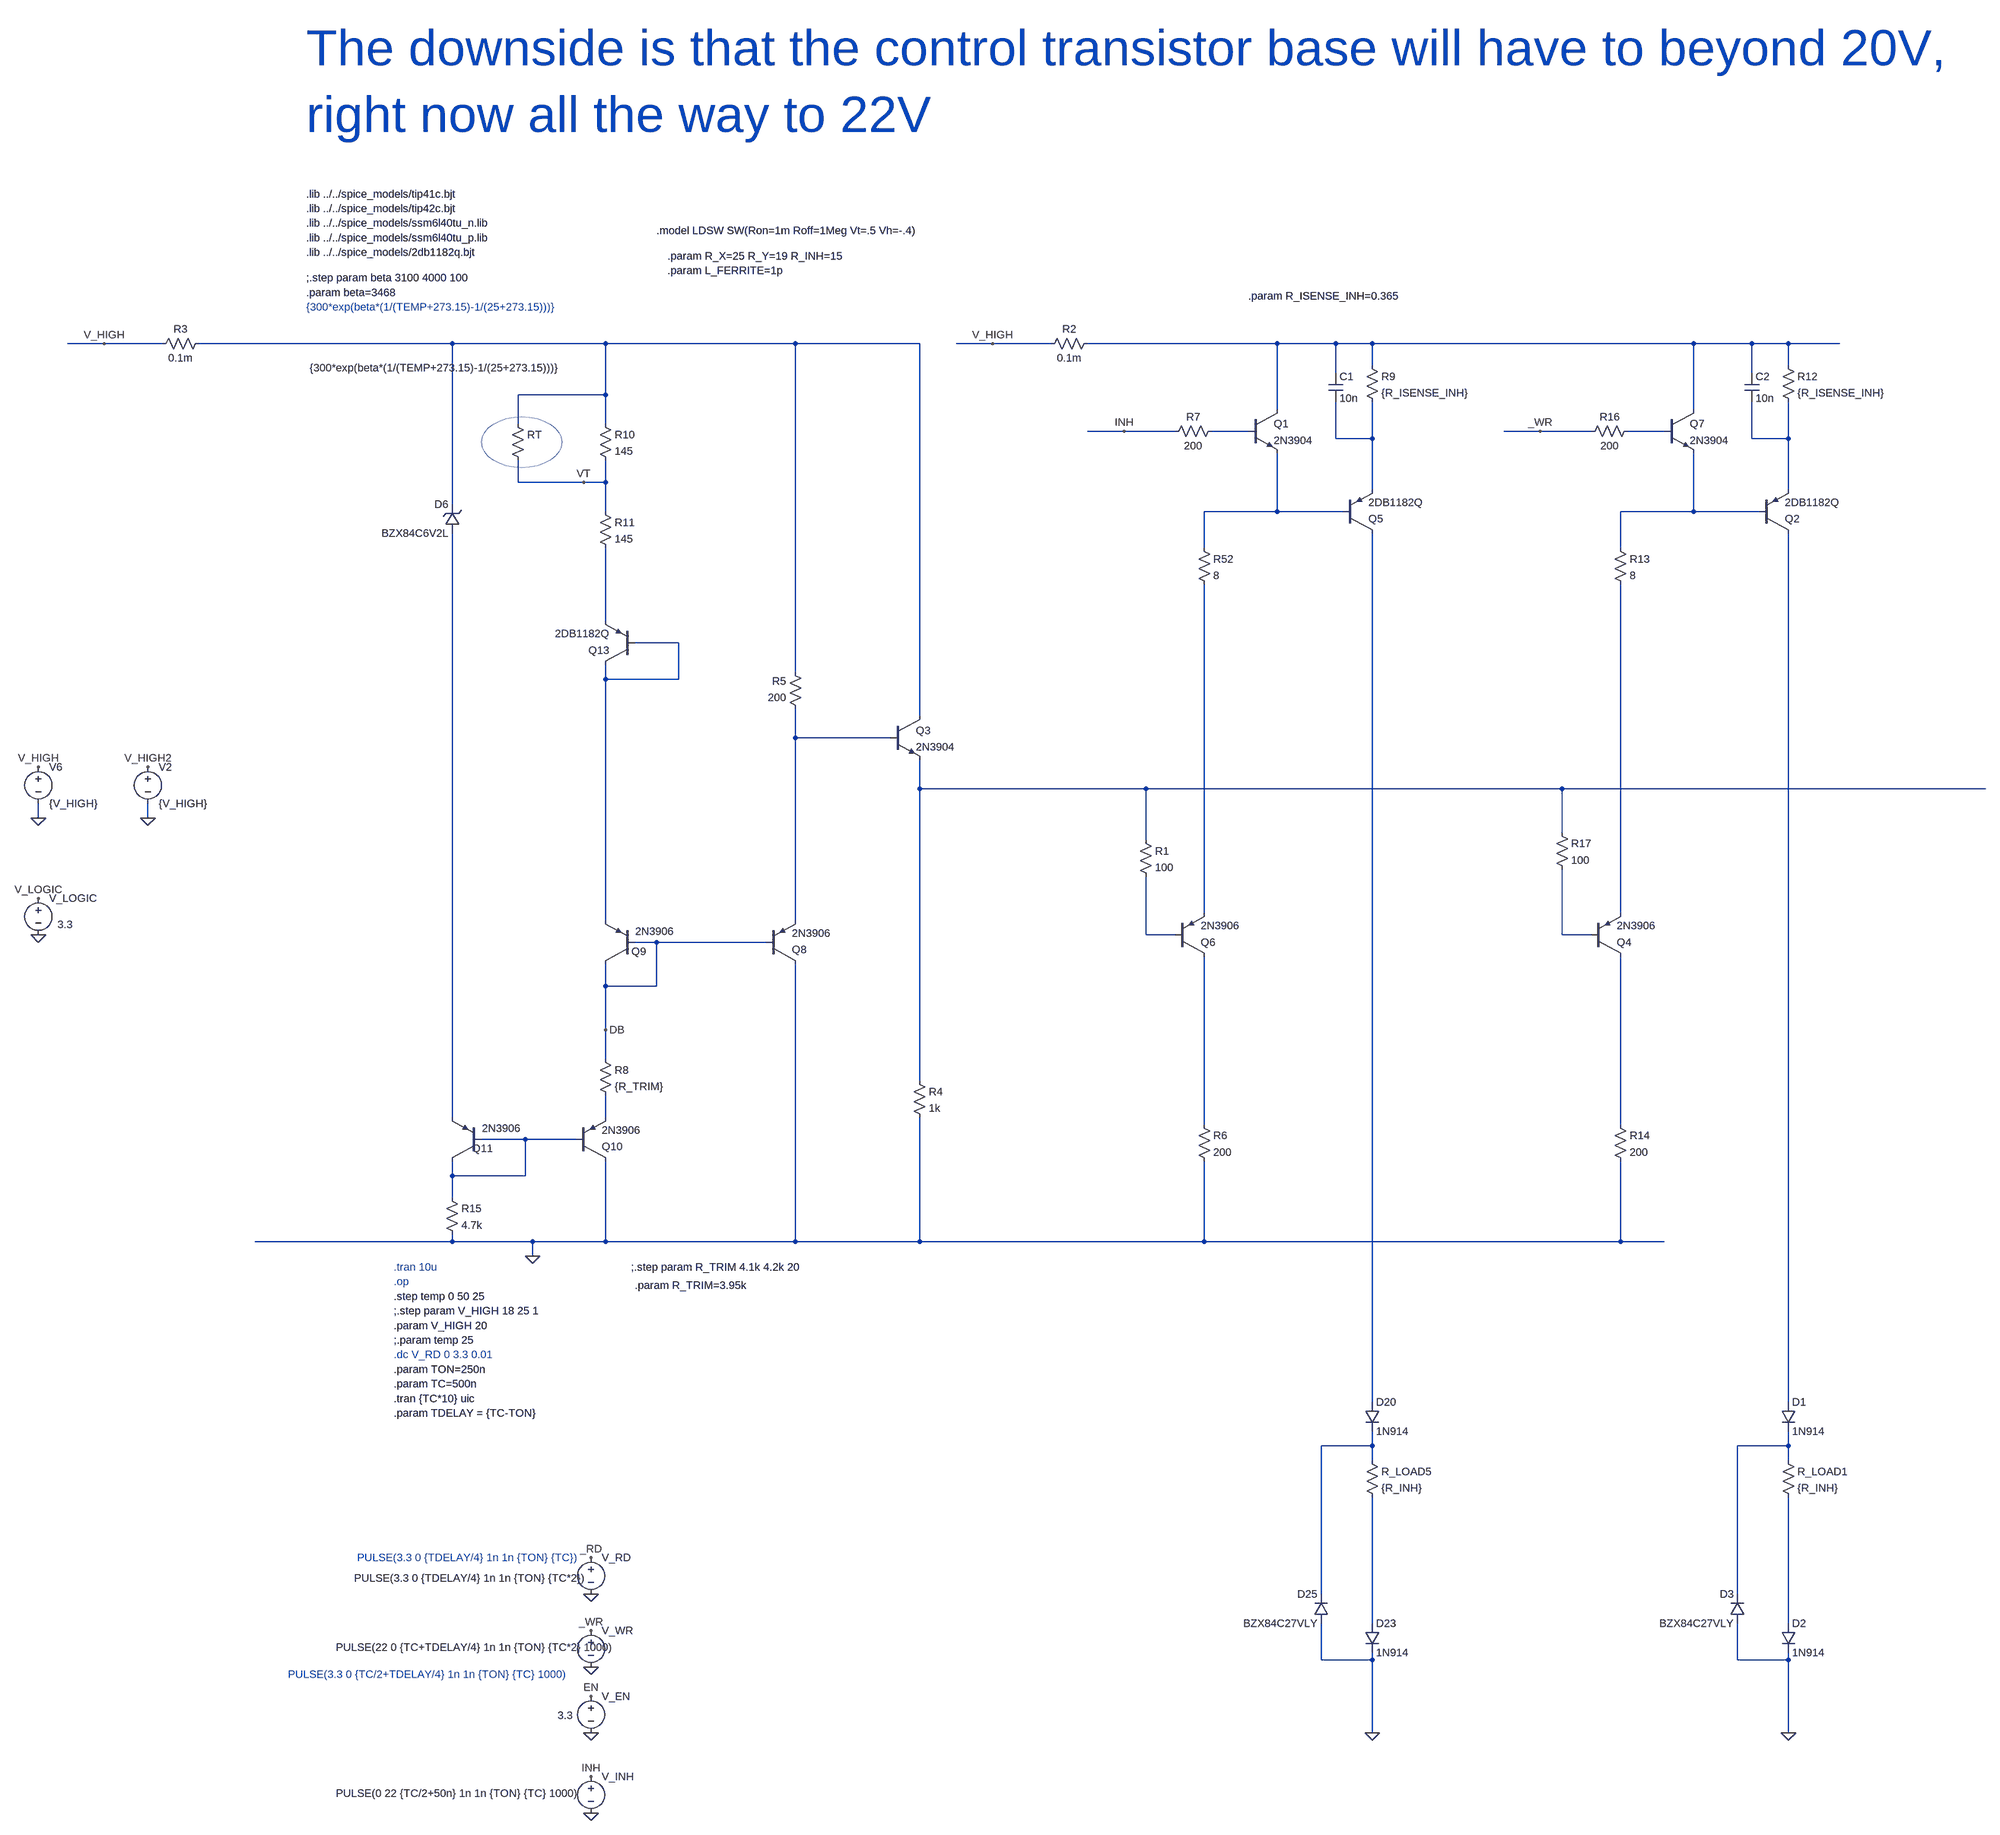
[diagram p0: schematic current_source_with_switch.asc]
current_source_with_switch.asc, the LTspice schematic file:
Version 4.1
SHEET 1 14296 6532
WIRE -1088 -3552 -1168 -3552
WIRE -960 -3552 -1088 -3552
WIRE -320 -3552 -880 -3552
WIRE 16 -3552 -320 -3552
WIRE 432 -3552 16 -3552
WIRE 704 -3552 432 -3552
WIRE 864 -3552 784 -3552
WIRE 992 -3552 864 -3552
WIRE 1488 -3552 1072 -3552
WIRE 1616 -3552 1488 -3552
WIRE 1696 -3552 1616 -3552
WIRE 2400 -3552 1696 -3552
WIRE 2528 -3552 2400 -3552
WIRE 2608 -3552 2528 -3552
WIRE 2720 -3552 2608 -3552
WIRE 1696 -3504 1696 -3552
WIRE 2608 -3504 2608 -3552
WIRE 1616 -3488 1616 -3552
WIRE 2528 -3488 2528 -3552
WIRE 16 -3440 16 -3552
WIRE 16 -3440 -176 -3440
WIRE 1488 -3408 1488 -3552
WIRE 2400 -3408 2400 -3552
WIRE -176 -3376 -176 -3440
WIRE 16 -3376 16 -3440
WIRE 1152 -3360 1072 -3360
WIRE 1264 -3360 1152 -3360
WIRE 1424 -3360 1344 -3360
WIRE 2064 -3360 1984 -3360
WIRE 2176 -3360 2064 -3360
WIRE 2336 -3360 2256 -3360
WIRE 1616 -3344 1616 -3424
WIRE 1696 -3344 1696 -3424
WIRE 1696 -3344 1616 -3344
WIRE 2528 -3344 2528 -3424
WIRE 2608 -3344 2608 -3424
WIRE 2608 -3344 2528 -3344
WIRE -176 -3248 -176 -3296
WIRE -32 -3248 -176 -3248
WIRE 16 -3248 16 -3296
WIRE 16 -3248 -32 -3248
WIRE 1696 -3232 1696 -3344
WIRE 2608 -3232 2608 -3344
WIRE -320 -3200 -320 -3552
WIRE 16 -3184 16 -3248
WIRE 1488 -3184 1488 -3312
WIRE 1488 -3184 1328 -3184
WIRE 1632 -3184 1488 -3184
WIRE 2400 -3184 2400 -3312
WIRE 2400 -3184 2240 -3184
WIRE 2544 -3184 2400 -3184
WIRE 1328 -3104 1328 -3184
WIRE 2240 -3104 2240 -3184
WIRE 16 -2944 16 -3104
WIRE 176 -2896 80 -2896
WIRE 432 -2832 432 -3552
WIRE 16 -2816 16 -2848
WIRE 176 -2816 176 -2896
WIRE 176 -2816 16 -2816
WIRE 704 -2736 704 -3552
WIRE 432 -2688 432 -2752
WIRE 640 -2688 432 -2688
WIRE 704 -2576 704 -2640
WIRE 1200 -2576 704 -2576
WIRE 2112 -2576 1200 -2576
WIRE 3040 -2576 2112 -2576
WIRE -1232 -2512 -1232 -2544
WIRE -992 -2512 -992 -2544
WIRE 2112 -2480 2112 -2576
WIRE 1200 -2464 1200 -2576
WIRE 1328 -2304 1328 -3024
WIRE 2240 -2304 2240 -3024
WIRE 16 -2288 16 -2816
WIRE 432 -2288 432 -2688
WIRE 1200 -2256 1200 -2384
WIRE 1264 -2256 1200 -2256
WIRE 2112 -2256 2112 -2400
WIRE 2176 -2256 2112 -2256
WIRE 128 -2240 80 -2240
WIRE 368 -2240 128 -2240
WIRE 16 -2144 16 -2192
WIRE 128 -2144 128 -2240
WIRE 128 -2144 16 -2144
WIRE 16 -2048 16 -2144
WIRE 16 -1984 16 -2048
WIRE 704 -1936 704 -2576
WIRE -320 -1856 -320 -3136
WIRE 16 -1856 16 -1904
WIRE 1328 -1840 1328 -2208
WIRE 2240 -1840 2240 -2208
WIRE -160 -1808 -256 -1808
WIRE -48 -1808 -160 -1808
WIRE -320 -1728 -320 -1760
WIRE -160 -1728 -160 -1808
WIRE -160 -1728 -320 -1728
WIRE -320 -1680 -320 -1728
WIRE -320 -1584 -320 -1600
WIRE -320 -1584 -752 -1584
WIRE -144 -1584 -320 -1584
WIRE 16 -1584 16 -1760
WIRE 16 -1584 -144 -1584
WIRE 432 -1584 432 -2192
WIRE 432 -1584 16 -1584
WIRE 704 -1584 704 -1856
WIRE 704 -1584 432 -1584
WIRE 1328 -1584 1328 -1760
WIRE 1328 -1584 704 -1584
WIRE 2240 -1584 2240 -1760
WIRE 2240 -1584 1328 -1584
WIRE 2336 -1584 2240 -1584
WIRE -144 -1552 -144 -1584
WIRE 1696 -1232 1696 -3136
WIRE 2608 -1232 2608 -3136
WIRE 1696 -1136 1696 -1168
WIRE 1696 -1136 1584 -1136
WIRE 2608 -1136 2608 -1168
WIRE 2608 -1136 2496 -1136
WIRE 1696 -1104 1696 -1136
WIRE 2608 -1104 2608 -1136
WIRE 1584 -768 1584 -1136
WIRE 2496 -768 2496 -1136
WIRE 1696 -704 1696 -1024
WIRE 2608 -704 2608 -1024
WIRE 1584 -624 1584 -704
WIRE 1696 -624 1696 -640
WIRE 1696 -624 1584 -624
WIRE 2496 -624 2496 -704
WIRE 2608 -624 2608 -640
WIRE 2608 -624 2496 -624
WIRE 1696 -464 1696 -624
WIRE 2608 -464 2608 -624
FLAG -144 -1552 0
FLAG -32 -3248 VT
FLAG 16 -2048 DB
FLAG 864 -3552 V_HIGH
FLAG -1088 -3552 V_HIGH
FLAG -1232 -2512 0
FLAG -1232 -2624 V_HIGH
FLAG -16 -848 _RD
FLAG -16 -768 0
FLAG -16 -544 EN
FLAG -16 -464 0
FLAG -1232 -2336 V_LOGIC
FLAG -1232 -2256 0
FLAG -16 -368 INH
FLAG -16 -288 0
FLAG 1696 -464 0
FLAG -992 -2512 0
FLAG -992 -2624 V_HIGH2
FLAG -16 -688 _WR
FLAG -16 -608 0
FLAG 1152 -3360 INH
FLAG 2608 -464 0
FLAG 2064 -3360 _WR
SYMBOL res 0 -2000 R0
SYMATTR InstName R8
SYMATTR Value {R_TRIM}
SYMBOL res 1680 -3520 R0
SYMATTR InstName R9
SYMATTR Value {R_ISENSE_INH}
SYMBOL pnp 1632 -3136 M180
SYMATTR InstName Q5
SYMATTR Value 2DB1182Q
SYMBOL pnp 368 -2192 M180
SYMATTR InstName Q8
SYMATTR Value 2N3906
SYMBOL pnp 80 -2192 R180
WINDOW 0 -25 28 Left 2
WINDOW 3 -86 72 Left 2
SYMATTR InstName Q9
SYMATTR Value 2N3906
SYMBOL res 0 -3392 R0
SYMATTR InstName R10
SYMATTR Value 145
SYMBOL res 0 -3200 R0
SYMATTR InstName R11
SYMATTR Value 145
SYMBOL res -192 -3392 R0
WINDOW 3 -440 -107 Left 2
SYMATTR Value {300*exp(beta*(1/(TEMP+273.15)-1/(25+273.15)))}
SYMATTR InstName RT
SYMBOL zener -304 -3136 R180
WINDOW 0 24 64 Left 2
WINDOW 3 24 0 Left 2
SYMATTR InstName D6
SYMATTR Value BZX84C6V2L
SYMBOL res -336 -1696 R0
SYMATTR InstName R15
SYMATTR Value 4.7k
SYMBOL pnp -48 -1760 M180
SYMATTR InstName Q10
SYMATTR Value 2N3906
SYMBOL pnp -256 -1760 R180
WINDOW 0 -25 28 Left 2
WINDOW 3 -86 72 Left 2
SYMATTR InstName Q11
SYMATTR Value 2N3906
SYMBOL npn 640 -2736 R0
SYMATTR InstName Q3
SYMATTR Value 2N3904
SYMBOL pnp 1264 -2208 M180
SYMATTR InstName Q6
SYMATTR Value 2N3906
SYMBOL res 688 -1952 R0
SYMATTR InstName R4
SYMATTR Value 1k
SYMBOL pnp 80 -2848 R180
SYMATTR InstName Q13
SYMATTR Value 2DB1182Q
SYMBOL res 448 -2736 R180
WINDOW 0 36 76 Left 2
WINDOW 3 36 40 Left 2
SYMATTR InstName R5
SYMATTR Value 200
SYMBOL res 976 -3536 R270
WINDOW 0 32 56 VTop 2
WINDOW 3 0 56 VBottom 2
SYMATTR InstName R2
SYMATTR Value 0.1m
SYMBOL res -976 -3536 R270
WINDOW 0 32 56 VTop 2
WINDOW 3 0 56 VBottom 2
SYMATTR InstName R3
SYMATTR Value 0.1m
SYMBOL voltage -1232 -2640 R0
SYMATTR InstName V6
SYMATTR Value {V_HIGH}
SYMBOL voltage -16 -864 R0
WINDOW 123 0 0 Left 0
WINDOW 39 0 0 Left 0
WINDOW 3 -519 61 Left 2
SYMATTR Value PULSE(3.3 0 {TDELAY/4} 1n 1n {TON} {TC*2})
SYMATTR InstName V_RD
SYMBOL voltage -16 -560 R0
WINDOW 123 0 0 Left 0
WINDOW 39 0 0 Left 0
WINDOW 3 -73 58 Left 2
SYMATTR Value 3.3
SYMATTR InstName V_EN
SYMBOL voltage -1232 -2352 R0
WINDOW 123 0 0 Left 0
WINDOW 39 0 0 Left 0
WINDOW 3 42 73 Left 2
SYMATTR Value 3.3
SYMATTR InstName V_LOGIC
SYMBOL res 1680 -1120 R0
SYMATTR InstName R_LOAD5
SYMATTR Value {R_INH}
SYMBOL voltage -16 -384 R0
WINDOW 123 0 0 Left 0
WINDOW 39 0 0 Left 0
WINDOW 3 -559 53 Left 2
SYMATTR Value PULSE(0 22 {TC/2+50n} 1n 1n {TON} {TC} 1000)
SYMATTR InstName V_INH
SYMBOL diode 1680 -1232 R0
SYMATTR InstName D20
SYMATTR Value 1N914
SYMBOL diode 1680 -704 R0
SYMATTR InstName D23
SYMATTR Value 1N914
SYMBOL diode 1600 -704 R180
WINDOW 0 24 64 Left 2
WINDOW 3 24 0 Left 2
SYMATTR InstName D25
SYMATTR Value BZX84C27VLY
SYMBOL res 1312 -3120 R0
SYMATTR InstName R52
SYMATTR Value 8
SYMBOL voltage -992 -2640 R0
SYMATTR InstName V2
SYMATTR Value {V_HIGH}
SYMBOL voltage -16 -704 R0
WINDOW 123 0 0 Left 0
WINDOW 39 0 0 Left 0
WINDOW 3 -559 53 Left 2
SYMATTR Value PULSE(22 0 {TC+TDELAY/4} 1n 1n {TON} {TC*2} 1000)
SYMATTR InstName V_WR
SYMBOL npn 1424 -3408 R0
SYMATTR InstName Q1
SYMATTR Value 2N3904
SYMBOL res 1312 -1856 R0
SYMATTR InstName R6
SYMATTR Value 200
SYMBOL res 1360 -3376 R90
WINDOW 0 0 56 VBottom 2
WINDOW 3 32 56 VTop 2
SYMATTR InstName R7
SYMATTR Value 200
SYMBOL res 2592 -3520 R0
SYMATTR InstName R12
SYMATTR Value {R_ISENSE_INH}
SYMBOL pnp 2544 -3136 M180
SYMATTR InstName Q2
SYMATTR Value 2DB1182Q
SYMBOL pnp 2176 -2208 M180
SYMATTR InstName Q4
SYMATTR Value 2N3906
SYMBOL res 2592 -1120 R0
SYMATTR InstName R_LOAD1
SYMATTR Value {R_INH}
SYMBOL diode 2592 -1232 R0
SYMATTR InstName D1
SYMATTR Value 1N914
SYMBOL diode 2592 -704 R0
SYMATTR InstName D2
SYMATTR Value 1N914
SYMBOL diode 2512 -704 R180
WINDOW 0 24 64 Left 2
WINDOW 3 24 0 Left 2
SYMATTR InstName D3
SYMATTR Value BZX84C27VLY
SYMBOL res 2224 -3120 R0
SYMATTR InstName R13
SYMATTR Value 8
SYMBOL npn 2336 -3408 R0
SYMATTR InstName Q7
SYMATTR Value 2N3904
SYMBOL res 2224 -1856 R0
SYMATTR InstName R14
SYMATTR Value 200
SYMBOL res 2272 -3376 R90
WINDOW 0 0 56 VBottom 2
WINDOW 3 32 56 VTop 2
SYMATTR InstName R16
SYMATTR Value 200
SYMBOL cap 1600 -3488 R0
SYMATTR InstName C1
SYMATTR Value 10n
SYMBOL cap 2512 -3488 R0
SYMATTR InstName C2
SYMATTR Value 10n
SYMBOL res 1184 -2480 R0
SYMATTR InstName R1
SYMATTR Value 100
SYMBOL res 2096 -2496 R0
SYMATTR InstName R17
SYMATTR Value 100
TEXT -640 -3848 Left 2 !.lib ../../spice_models/tip42c.bjt
TEXT -640 -3880 Left 2 !.lib ../../spice_models/tip41c.bjt
TEXT -448 -1464 Left 2 !.step temp 0 50 25
TEXT -448 -1496 Left 2 ;.op
TEXT -448 -1432 Left 2 !;.step param V_HIGH 18 25 1
TEXT -640 -3664 Left 2 !.param beta=3468
TEXT -640 -3696 Left 2 !;.step param beta 3100 4000 100
TEXT -640 -3632 Left 2 ;{300*exp(beta*(1/(TEMP+273.15)-1/(25+273.15)))}
TEXT 152 -3712 Left 2 !.param L_FERRITE=1p
TEXT 152 -3744 Left 2 !.param R_X=25 R_Y=19 R_INH=15
TEXT 1424 -3656 Left 2 !.param R_ISENSE_INH=0.365
TEXT 72 -1528 Left 2 !;.step param R_TRIM 4.1k 4.2k 20
TEXT 80 -1488 Left 2 !.param R_TRIM=3.95k
TEXT -448 -1400 Left 2 !.param V_HIGH 20
TEXT -448 -1368 Left 2 !;.param temp 25
TEXT 128 -3800 Left 2 !.model LDSW SW(Ron=1m Roff=1Meg Vt=.5 Vh=-.4)
TEXT -448 -1528 Left 2 ;.tran 10u
TEXT -448 -1240 Left 2 !.tran {TC*10} uic
TEXT -448 -1304 Left 2 !.param TON=250n
TEXT -448 -1272 Left 2 !.param TC=500n
TEXT -448 -1336 Left 2 ;.dc V_RD 0 3.3 0.01
TEXT -528 -848 Left 2 ;PULSE(3.3 0 {TDELAY/4} 1n 1n {TON} {TC})
TEXT -640 -3816 Left 2 !.lib ../../spice_models/ssm6l40tu_n.lib
TEXT -640 -3784 Left 2 !.lib ../../spice_models/ssm6l40tu_p.lib
TEXT -448 -1208 Left 2 !.param TDELAY = {TC-TON}
TEXT -640 -3752 Left 2 !.lib ../../spice_models/2db1182q.bjt
TEXT -680 -592 Left 2 ;PULSE(3.3 0 {TC/2+TDELAY/4} 1n 1n {TON} {TC} 1000)
TEXT -640 -4312 Left 7 ;The downside is that the control transistor base will have to beyond 20V,\nright now all the way to 22V
CIRCLE Normal -80 -3280 -256 -3392 2

The netlist it stands for:
* current_source_with_switch.asc
R8 DB N018 {R_TRIM}
R9 N002 N005 {R_ISENSE_INH}
Q5 N022 N007 N005 0 2DB1182Q
Q8 0 DB N011 0 2N3906
Q9 DB DB N010 0 2N3906
R10 N001 VT 145
R11 VT N009 145
RT N001 VT {300*exp(beta*(1/(TEMP+273.15)-1/(25+273.15)))}
D6 N017 N001 BZX84C6V2L
R15 N021 0 4.7k
Q10 0 N021 N018 0 2N3906
Q11 N021 N021 N017 0 2N3906
Q3 N001 N011 N012 0 2N3904
Q6 N019 N015 N013 0 2N3906
R4 N012 0 1k
Q13 N010 N010 N009 0 2DB1182Q
R5 N011 N001 200
R2 V_HIGH N002 0.1m
R3 V_HIGH N001 0.1m
V6 V_HIGH 0 {V_HIGH}
V_RD _RD 0 PULSE(3.3 0 {TDELAY/4} 1n 1n {TON} {TC*2})
V_EN EN 0 3.3
V_LOGIC V_LOGIC 0 3.3
R_LOAD5 N024 N026 {R_INH}
V_INH INH 0 PULSE(0 22 {TC/2+50n} 1n 1n {TON} {TC} 1000)
D20 N022 N024 1N914
D23 N026 0 1N914
D25 0 N024 BZX84C27VLY
R52 N007 N013 8
V2 V_HIGH2 0 {V_HIGH}
V_WR _WR 0 PULSE(22 0 {TC+TDELAY/4} 1n 1n {TON} {TC*2} 1000)
Q1 N002 N003 N007 0 2N3904
R6 N019 0 200
R7 N003 INH 200
R12 N002 N006 {R_ISENSE_INH}
Q2 N023 N008 N006 0 2DB1182Q
Q4 N020 N016 N014 0 2N3906
R_LOAD1 N025 N027 {R_INH}
D1 N023 N025 1N914
D2 N027 0 1N914
D3 0 N025 BZX84C27VLY
R13 N008 N014 8
Q7 N002 N004 N008 0 2N3904
R14 N020 0 200
R16 N004 _WR 200
C1 N002 N005 10n
C2 N002 N006 10n
R1 N012 N015 100
R17 N012 N016 100
.model D D
.lib standard.dio
.model NPN NPN
.model PNP PNP
.lib standard.bjt
.lib ../../spice_models/tip42c.bjt
.lib ../../spice_models/tip41c.bjt
.step temp 0 50 25
* .op
;.step param V_HIGH 18 25 1
.param beta=3468
;.step param beta 3100 4000 100
* {300*exp(beta*(1/(TEMP+273.15)-1/(25+273.15)))}
.param L_FERRITE=1p
.param R_X=25 R_Y=19 R_INH=15
.param R_ISENSE_INH=0.365
;.step param R_TRIM 4.1k 4.2k 20
.param R_TRIM=3.95k
.param V_HIGH 20
;.param temp 25
.model LDSW SW(Ron=1m Roff=1Meg Vt=.5 Vh=-.4)
* .tran 10u
.tran {TC*10} uic
.param TON=250n
.param TC=500n
* .dc V_RD 0 3.3 0.01
* PULSE(3.3 0 {TDELAY/4} 1n 1n {TON} {TC})
.lib ../../spice_models/ssm6l40tu_n.lib
.lib ../../spice_models/ssm6l40tu_p.lib
.param TDELAY = {TC-TON}
.lib ../../spice_models/2db1182q.bjt
* PULSE(3.3 0 {TC/2+TDELAY/4} 1n 1n {TON} {TC} 1000)
* The downside is that the control transistor base will have to beyond 20V,
* right now all the way to 22V
.backanno
.end